# Altium schematic sheet PAGE113.SchDoc
size 386 x 284 mm
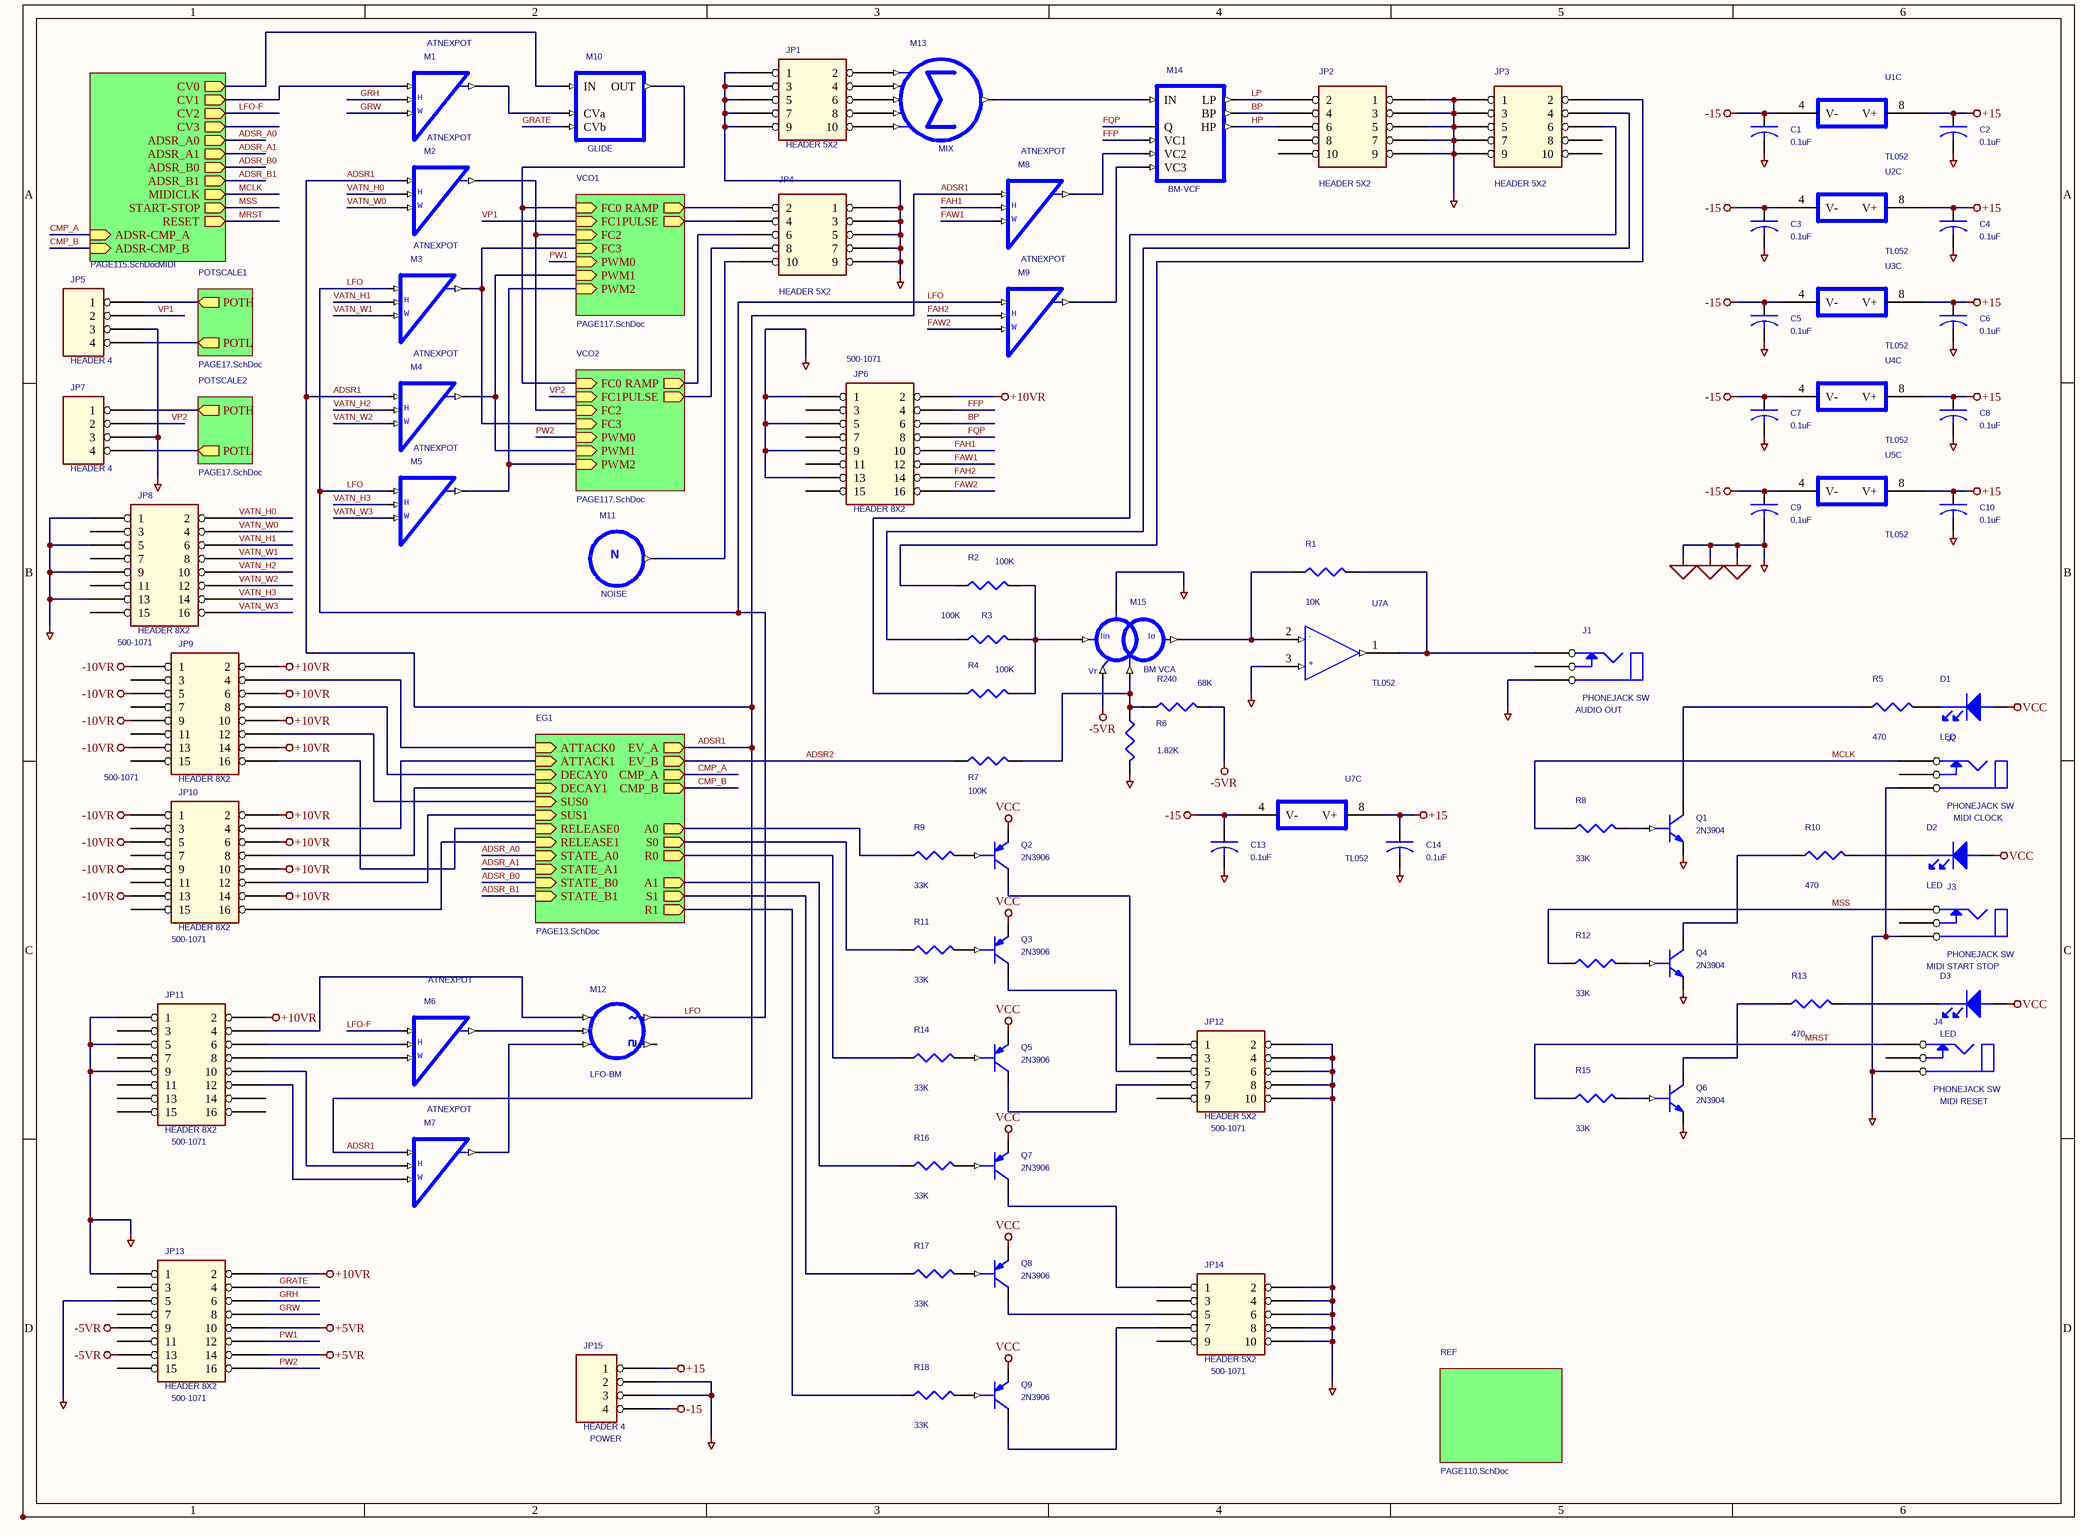
[diagram p0: PAGE113.SchDoc]

## Parts
C1  0.1uF  [AXIALCAP0.3]
C2  0.1uF  [AXIALCAP0.3]
C3  0.1uF  [AXIALCAP0.3]
C4  0.1uF  [AXIALCAP0.3]
C5  0.1uF  [AXIALCAP0.3]
C6  0.1uF  [AXIALCAP0.3]
C7  0.1uF  [AXIALCAP0.3]
C8  0.1uF  [AXIALCAP0.3]
C9  0.1uF  [AXIALCAP0.3]
C10  0.1uF  [AXIALCAP0.3]
C13  0.1uF  [AXIALCAP0.3]
C14  0.1uF  [AXIALCAP0.3]
D1  LED
D2  LED
D3  LED
J1  PHONEJACK SW  [PHONE-N114A]
J2  PHONEJACK SW  [PHONE-N114A]
J3  PHONEJACK SW  [PHONE-N114A]
J4  PHONEJACK SW  [PHONE-N114A]
JP1  HEADER 5X2  [IDC10-AMP]
JP2  HEADER 5X2  [IDC10-AMP]
JP3  HEADER 5X2  [IDC10-AMP]
JP4  HEADER 5X2  [IDC10-AMP]
JP5  HEADER 4  [MODU-4S-RA]
JP6  HEADER 8X2  [IDC16-AMP]
JP7  HEADER 4  [MODU-4S-RA]
JP8  HEADER 8X2  [IDC16-AMP]
JP9  HEADER 8X2  [IDC16-AMP]
JP10  HEADER 8X2  [IDC16-AMP]
JP11  HEADER 8X2  [IDC16-AMP]
JP12  HEADER 5X2  [IDC10-AMP]
JP13  HEADER 8X2  [IDC16-AMP]
JP14  HEADER 5X2  [IDC10-AMP]
JP15  HEADER 4  [MTA-4X156-RA]
M1  ATNEXPOT
M2  ATNEXPOT
M3  ATNEXPOT
M4  ATNEXPOT
M5  ATNEXPOT
M6  ATNEXPOT
M7  ATNEXPOT
M8  ATNEXPOT
M9  ATNEXPOT
M10  GLIDE
M11  NOISE
M12  LFO-BM
M13  MIX
M14  BM-VCF
M15  BM VCA
Q1  2N3904  [TO92]
Q2  2N3906  [TO92]
Q3  2N3906  [TO92]
Q4  2N3904  [TO92]
Q5  2N3906  [TO92]
Q6  2N3904  [TO92]
Q7  2N3906  [TO92]
Q8  2N3906  [TO92]
Q9  2N3906  [TO92]
R1  10K  [AXIAL0.4]
R2  100K  [AXIAL0.4]
R3  100K  [AXIAL0.4]
R4  100K  [AXIAL0.4]
R5  470  [AXIAL0.4]
R6  1.82K  [AXIAL0.4]
R7  100K  [AXIAL0.4]
R8  33K  [AXIAL0.4]
R9  33K  [AXIAL0.4]
R10  470  [AXIAL0.4]
R11  33K  [AXIAL0.4]
R12  33K  [AXIAL0.4]
R13  470  [AXIAL0.4]
R14  33K  [AXIAL0.4]
R15  33K  [AXIAL0.4]
R16  33K  [AXIAL0.4]
R17  33K  [AXIAL0.4]
R18  33K  [AXIAL0.4]
R240  68K  [AXIAL0.4]
U1  TL052  [DIP8]  (part C of 3)
U2  TL052  [DIP8]  (part C of 3)
U3  TL052  [DIP8]  (part C of 3)
U4  TL052  [DIP8]  (part C of 3)
U5  TL052  [DIP8]  (part C of 3)
U7  TL052  [DIP8]  (parts A,C of 3)

## Sub-sheets
EG1 = PAGE13.SchDoc: ATTACK0 (in), ATTACK1 (in), DECAY0 (in), DECAY1 (in), SUS0 (in), SUS1 (in), RELEASE0 (in), RELEASE1 (in), STATE_A0 (in), STATE_A1 (in), STATE_B0 (in), STATE_B1 (in), EV_A (out), EV_B (out), CMP_A (out), CMP_B (out), A0 (out), A1 (out), S0 (out), S1 (out), R0 (out), R1 (out)  | M26_PartReference: M26; M26_Q__11_PartReference: Q13; M26_Q__8_PartReference: Q10; M26_C__17_PartReference: C116; M26_U__17_PartReference: U11; M26_U__17_PACKAGE: ADSR_1; M26_Q__9_PartReference: Q11; M26_C__18_PartReference: C117; M26_R__43_PartReference: R28; M26_C__19_PartReference: C118; M26_U__12_PartReference: U12; M26_U__12_PACKAGE: ADSR_2; M26_R__44_PartReference: R31; M26_C__20_PartReference: C119; M26_R__45_PartReference: R33; M26_Q__10_PartReference: Q12; M26_C__15_PartReference: C20; M26_U__13_PartReference: U12; M26_U__13_PACKAGE: ADSR_2; M26_R__39_PartReference: R30; M26_U__14_PartReference: U11; M26_U__14_PACKAGE: ADSR_1; M26_C__16_PartReference: C21; M26_U__15_PartReference: U12; M26_U__15_PACKAGE: ADSR_2; M26_R__40_PartReference: R34; M26_U__16_PartReference: U11; M26_U__16_PACKAGE: ADSR_1; M26_R__41_PartReference: R32; M26_R__46_PartReference: R29; M26_R__42_PartReference: R37; M26_TitleBlock_7_Page_Number: 3; M26_TitleBlock_7_Title: SIMPLE EV GENERATOR M26; M27_PartReference: M27; M27_Q__11_PartReference: Q17; M27_Q__8_PartReference: Q14; M27_C__17_PartReference: C120; M27_U__17_PartReference: U13; M27_U__17_PACKAGE: ADSR_1_1; M27_Q__9_PartReference: Q15; M27_C__18_PartReference: C121; M27_R__43_PartReference: R38; M27_C__19_PartReference: C122; M27_U__12_PartReference: U14; M27_U__12_PACKAGE: ADSR_2_1; M27_R__44_PartReference: R41; M27_C__20_PartReference: C123; M27_R__45_PartReference: R43; M27_Q__10_PartReference: Q16; M27_C__15_PartReference: C22; M27_U__13_PartReference: U14; M27_U__13_PACKAGE: ADSR_2_1; M27_R__39_PartReference: R40; M27_U__14_PartReference: U13; M27_U__14_PACKAGE: ADSR_1_1; M27_C__16_PartReference: C23; M27_U__15_PartReference: U14; M27_U__15_PACKAGE: ADSR_2_1; M27_R__40_PartReference: R44; M27_U__16_PartReference: U13; M27_U__16_PACKAGE: ADSR_1_1; M27_R__41_PartReference: R42; M27_R__46_PartReference: R39; M27_R__42_PartReference: R47; M27_TitleBlock_7_Page_Number: 4; M27_TitleBlock_7_Title: SIMPLE EV GENERATOR M27; TitleBlock_Page_Number: 20; TitleBlock_Title: NOOTA-DUAL ENVELOPE GENERATOR
MIDI = PAGE115.SchDoc: CV0 (out), CV1 (out), CV2 (out), CV3 (out), ADSR_A0 (out), ADSR_A1 (out), ADSR_B0 (out), ADSR_B1 (out), MIDICLK (out), START-STOP (out), RESET (out), ADSR-CMP_A (in), ADSR-CMP_B (in)  | M26_PartReference: M26; M26_TitleBlock_1_Page_Number: 10; M26_TitleBlock_1_Title: MIDI CONNECTORS; U__4_PartReference: U9; M27_PartReference: M27; M27_C__21_PartReference: C41; M27_TitleBlock_1_Page_Number: 12; M27_TitleBlock_1_Title: MIDI CONNECTORS; U__5_PartReference: U9; U__6_PartReference: U9; M28_TitleBlock_1_Page_Number: 14; M28_TitleBlock_1_Title: MIDI CONNECTORS; M29_TitleBlock_4_Page_Number: 11; M31_C__13_PartReference: C48; M31_M34_C__21_PartReference: C66; M31_M34_TitleBlock_1_Page_Number: 28; M31_M34_TitleBlock_1_Title: MIDI CONNECTORS; M31_C__14_PartReference: U25; TitleBlock_Page_Number: 2; TitleBlock_Title: NOOTA-DUAL ENVELOPE GENERATOR
POTSCALE1 = PAGE17.SchDoc: POTH (out), POTL (out)  | R__16_PartReference: R133; M26_PartReference: U34; M26_PACKAGE: POTSCALE2; R__2_PartReference: R129; M27_PartReference: U34; M27_PACKAGE: POTSCALE2; R__3_PartReference: R128; U__PartReference: U34; U__PACKAGE: POTSCALE2; R__5_PartReference: R130; R__17_PartReference: R131; R__19_PartReference: R132; R__12_PartReference: R134; C__2_PartReference: C62; C__3_PartReference: C63; TitleBlock_Page_Number: 22; TitleBlock_Title: NOOTA-POT SCALE VCO 1
POTSCALE2 = PAGE17.SchDoc: POTH (out), POTL (out)  | R__16_PartReference: R141; M26_PartReference: U35; M26_PACKAGE: POTSCALE1; R__2_PartReference: R137; M27_PartReference: U35; M27_PACKAGE: POTSCALE1; R__3_PartReference: R136; U__PartReference: U35; U__PACKAGE: POTSCALE1; R__5_PartReference: R138; R__17_PartReference: R139; R__19_PartReference: R140; R__12_PartReference: R142; C__2_PartReference: C64; C__3_PartReference: C65; TitleBlock_Page_Number: 23; TitleBlock_Title: NOOTA-POT SCALE VCO 2
REF = PAGE110.SchDoc: no entries  | M26_PartReference: U50; U__4_PartReference: U50; M27_PartReference: U51; U__5_PartReference: U51; U__PartReference: Q57; U__PACKAGE: POTSCALE; C__8_PartReference: C113; U__6_PartReference: U50; Q__PartReference: Q58; R__PartReference: R225; TitleBlock_Page_Number: 40; TitleBlock_Title: NOOTA-DUAL ENVELOPE GENERATOR
VCO1 = PAGE117.SchDoc: FC0 (in), FC1 (in), FC2 (in), FC3 (in), PWM0 (in), PWM1 (in), PWM2 (in), RAMP (out), PULSE (out)  | R__34_PartReference: R102; R__1_PartReference: R100; R__35_PartReference: R98; R__23_PartReference: R92; M__1_PartReference: M22; M__1_M26_PartReference: U40; M__1_D__PartReference: D9; M__1_D__1_PartReference: D10; M__1_M27_PartReference: U40; M__1_C__PartReference: C78; M__1_U__PartReference: U40; M__1_U__PACKAGE: POTSCALE; M__1_C__1_PartReference: C79; M__1_R__7_PartReference: R160; M__1_R__10_PartReference: R161; M__1_R__11_PartReference: R159; M__1_R__13_PartReference: R158; M__1_R__20_PartReference: R162; M__1_R__21_PartReference: R164; M__1_R__22_PartReference: R163; M__1_TitleBlock_Page_Number: 31; M__1_TitleBlock_Title: NOOTA-DUAL ENVELOPE GENERATOR; M__PartReference: M21; M__U__18_PartReference: U39; M__C__23_PartReference: C74; M__Q__12_PartReference: Q40; M__U__19_PartReference: U38; M__C__22_PartReference: C71; M__C__24_PartReference: C73; M__C__25_PartReference: C72; M__C__26_PartReference: C75; M__R__49_PartReference: R154; M__C__27_PartReference: C76; M__R__50_PartReference: R157; M__R__47_PartReference: R155; M__R__48_PartReference: R156; M__TitleBlock_6_Page_Number: 30; R__4_PartReference: R99; R__28_PartReference: R89; R__24_PartReference: R94; R__37_PartReference: R87; U__8_PartReference: U28; U__8_PACKAGE: VCO1_1; C__9_PartReference: R105; C__9_PCB_Footprint: AXIAL0.4; C__11_PartReference: C52; R__25_PartReference: R95; R__18_PartReference: R88; R__38_PartReference: R91; R__29_PartReference: R106; R__9_PartReference: R90; R__PartReference: M20; R__M26_PartReference: Q38; R__U__7_PartReference: U37; R__U__7_PACKAGE: BMEXPO; R__M27_PartReference: Q39; R__U__2_PartReference: U37; R__U__2_PACKAGE: BMEXPO; R__U__PartReference: Q34; R__U__PACKAGE: POTSCALE; R__C__4_PartReference: C67; R__U__3_PartReference: U37; R__U__3_PACKAGE: BMEXPO; R__Q__PartReference: Q33; R__C__6_PartReference: C69; R__C__7_PartReference: C70; R__Q__1_PartReference: Q35; R__C__5_PartReference: C68; R__Q__2_PartReference: Q36; R__Q__3_PartReference: Q37; R__R__14_PartReference: R153; R__R__15_PartReference: R152; R__TitleBlock_Page_Number: 29; R__TitleBlock_Title: NOOTA-DUAL ENVELOPE GENERATOR; R__26_PartReference: R97; C__12_PartReference: C53; R__30_PartReference: R107; R__27_PartReference: R103; R__31_PartReference: R104; U__10_PartReference: U28; U__10_PACKAGE: VCO1_1; R__36_PartReference: R101; U__11_PartReference: U28; U__11_PACKAGE: VCO1_1; JP__PartReference: JP18; TitleBlock_Page_Number: 15; TitleBlock_Title: NOOTA-DUAL ENVELOPE GENERATOR
VCO2 = PAGE117.SchDoc: FC0 (in), FC1 (in), FC2 (in), FC3 (in), PWM0 (in), PWM1 (in), PWM2 (in), RAMP (out), PULSE (out)  | R__34_PartReference: R180; R__1_PartReference: R178; R__35_PartReference: R176; R__23_PartReference: R170; M__1_PartReference: M25; M__1_M26_PartReference: U45; M__1_M26_PACKAGE: RAMP_PWM1; M__1_D__PartReference: D11; M__1_D__1_PartReference: D12; M__1_M27_PartReference: U45; M__1_M27_PACKAGE: RAMP_PWM1; M__1_C__PartReference: C93; M__1_U__PartReference: U45; M__1_U__PACKAGE: RAMP_PWM1; M__1_C__1_PartReference: C94; M__1_R__7_PartReference: R194; M__1_R__10_PartReference: R195; M__1_R__11_PartReference: R193; M__1_R__13_PartReference: R192; M__1_R__20_PartReference: R196; M__1_R__21_PartReference: R198; M__1_R__22_PartReference: R197; M__1_TitleBlock_Page_Number: 35; M__1_TitleBlock_Title: NOOTA-DUAL ENVELOPE GENERATOR; M__PartReference: M24; M__U__18_PartReference: U44; M__C__23_PartReference: C89; M__Q__12_PartReference: Q48; M__U__19_PartReference: U43; M__C__22_PartReference: C86; M__C__24_PartReference: C88; M__C__25_PartReference: C87; M__C__26_PartReference: C90; M__R__49_PartReference: R188; M__C__27_PartReference: C91; M__R__50_PartReference: R191; M__R__47_PartReference: R189; M__R__48_PartReference: R190; M__TitleBlock_6_Page_Number: 34; R__4_PartReference: R177; R__28_PartReference: R167; R__24_PartReference: R172; R__37_PartReference: R165; U__8_PartReference: U41; U__8_PACKAGE: VCO1_2; C__9_PartReference: R183; C__9_PCB_Footprint: AXIAL0.4; C__11_PartReference: C80; R__25_PartReference: R173; R__18_PartReference: R166; R__38_PartReference: R169; R__29_PartReference: R184; R__9_PartReference: R168; R__PartReference: M23; R__M26_PartReference: Q46; R__U__7_PartReference: U42; R__U__7_PACKAGE: BMEXPO1; R__M27_PartReference: Q47; R__U__2_PartReference: U42; R__U__2_PACKAGE: BMEXPO1; R__U__PartReference: Q42; R__U__PACKAGE: POTSCALE; R__C__4_PartReference: C82; R__U__3_PartReference: U42; R__U__3_PACKAGE: BMEXPO1; R__Q__PartReference: Q41; R__C__6_PartReference: C84; R__C__7_PartReference: C85; R__Q__1_PartReference: Q43; R__C__5_PartReference: C83; R__Q__2_PartReference: Q44; R__Q__3_PartReference: Q45; R__R__14_PartReference: R187; R__R__15_PartReference: R186; R__TitleBlock_Page_Number: 33; R__TitleBlock_Title: NOOTA-DUAL ENVELOPE GENERATOR; R__26_PartReference: R175; C__12_PartReference: C81; R__30_PartReference: R185; R__27_PartReference: R181; R__31_PartReference: R182; U__10_PartReference: U41; U__10_PACKAGE: VCO1_2; R__36_PartReference: R179; U__11_PartReference: U41; U__11_PACKAGE: VCO1_2; JP__PartReference: JP19; TitleBlock_Page_Number: 32; TitleBlock_Title: NOOTA-DUAL ENVELOPE GENERATOR

## Nets
+5VR: JP13.10 JP13.14
+10VR: JP6.2 JP9.2 JP9.6 JP9.10 JP9.14 JP10.2 JP10.6 JP10.10 JP10.14 JP11.2 JP13.2
+15: C2.1 C4.1 C6.1 C8.1 C10.1 C14.1 JP15.1 U1.8(V+) U2.8(V+) U3.8(V+) U4.8(V+) U5.8(V+) U7.8(V+)
-5VR: JP13.9 JP13.13 M15.-VR R240.2
-10VR: JP9.1 JP9.5 JP9.9 JP9.13 JP10.1 JP10.5 JP10.9 JP10.13
-15: C1.1 C3.1 C5.1 C7.1 C9.1 C13.1 JP15.4 U1.4(V-) U2.4(V-) U3.4(V-) U4.4(V-) U5.4(V-) U7.4(V-)
AGND: C1.2 C2.2 C3.2 C4.2 C5.2 C6.2 C7.2 C8.2 C9.2 C10.2 C13.2 C14.2 J1.3 J2.3 J3.3 J4.3 JP1.1 JP1.3 JP1.5 JP1.7 JP1.9 JP2.1 JP2.3 JP2.5 JP2.7 JP2.9 JP3.1 JP3.3 JP3.5 JP3.7 JP3.9 JP4.1 JP4.3 JP4.5 JP4.7 JP4.9 JP5.3 JP6.1 JP6.5 JP6.9 JP6.13 JP7.3 JP8.1 JP8.5 JP8.9 JP8.13 JP11.1 JP11.5 JP11.9 JP12.2 JP12.4 JP12.6 JP12.8 JP12.10 JP13.1 JP13.5 JP14.2 JP14.4 JP14.6 JP14.8 JP14.10 JP15.2 JP15.3 M15.CVN Q1.EMITTER Q4.EMITTER Q6.EMITTER R6.2 U7.3(+)  [also labelled GND, VEE, VSS]
VCC: D1.ANODE D2.ANODE D3.ANODE Q2.EMITTER Q3.EMITTER Q5.EMITTER Q7.EMITTER Q8.EMITTER Q9.EMITTER
ADSR1: M2.IN M4.IN M7.IN M8.IN ; sheet EG1/EV_A
ADSR2: R7.1 ; sheet EG1/EV_B
ADSR_A0: sheet EG1/STATE_A0, sheet MIDI/ADSR_A0
ADSR_A1: sheet EG1/STATE_A1, sheet MIDI/ADSR_A1
ADSR_B0: sheet EG1/STATE_B0, sheet MIDI/ADSR_B0
ADSR_B1: sheet EG1/STATE_B1, sheet MIDI/ADSR_B1
BP: JP2.4 JP6.6 M14.BP
CMP_A: sheet EG1/CMP_A, sheet MIDI/ADSR-CMP_A
CMP_B: sheet EG1/CMP_B, sheet MIDI/ADSR-CMP_B
FAH1: JP6.10 M8.POT_H
FAH2: JP6.14 M9.POT_H
FAW1: JP6.12 M8.POT_W
FAW2: JP6.16 M9.POT_W
FFP: JP6.4 M14.VC1
FQP: JP6.8 M14.Q
GRATE: JP13.4 M10.CVb
GRH: JP13.6 M1.POT_H
GRW: JP13.8 M1.POT_W
HP: JP2.6 M14.HP
LFO: M3.IN M5.IN M9.IN M12.TRI
LFO-F: M6.IN ; sheet MIDI/CV2
LP: JP2.2 M14.LP
MCLK: J2.1 R8.1 ; sheet MIDI/MIDICLK
MRST: J4.1 R15.1 ; sheet MIDI/RESET
MSS: J3.1 R12.1 ; sheet MIDI/START-STOP
PW1: JP13.12 ; sheet VCO1/PWM0
PW2: JP13.16 ; sheet VCO2/PWM0
VATN_H0: JP8.2 M2.POT_H
VATN_H1: JP8.6 M3.POT_H
VATN_H2: JP8.10 M4.POT_H
VATN_H3: JP8.14 M5.POT_H
VATN_W0: JP8.4 M2.POT_W
VATN_W1: JP8.8 M3.POT_W
VATN_W2: JP8.12 M4.POT_W
VATN_W3: JP8.16 M5.POT_W
VP1: JP5.2 ; sheet VCO1/FC1
VP2: JP7.2 ; sheet VCO2/FC1
NetD1_CATHODE: D1.CATHODE R5.2
NetD2_CATHODE: D2.CATHODE R10.2
NetD3_CATHODE: D3.CATHODE R13.2
NetJ1_1: J1.1 R1.2 U7.1(OUT)
NetJP1_2: JP1.2 M13.I1
NetJP1_4: JP1.4 M13.I2
NetJP1_6: JP1.6 M13.I3
NetJP1_8: JP1.8 M13.I4
NetJP1_10: JP1.10 M13.I5
NetJP3_2: JP3.2 R2.1
NetJP3_4: JP3.4 R3.1
NetJP3_6: JP3.6 R4.1
NetJP4_2: JP4.2 ; sheet VCO1/RAMP
NetJP4_4: JP4.4 ; sheet VCO1/PULSE
NetJP4_6: JP4.6 ; sheet VCO2/RAMP
NetJP4_8: JP4.8 ; sheet VCO2/PULSE
NetJP4_10: JP4.10 M11.NOISE
NetJP5_1: JP5.1 ; sheet POTSCALE1/POTH
NetJP5_4: JP5.4 ; sheet POTSCALE1/POTL
NetJP7_1: JP7.1 ; sheet POTSCALE2/POTH
NetJP7_4: JP7.4 ; sheet POTSCALE2/POTL
NetJP9_4: JP9.4 ; sheet EG1/ATTACK0
NetJP9_8: JP9.8 ; sheet EG1/DECAY0
NetJP9_12: JP9.12 ; sheet EG1/SUS0
NetJP9_16: JP9.16 ; sheet EG1/RELEASE0
NetJP10_4: JP10.4 ; sheet EG1/ATTACK1
NetJP10_8: JP10.8 ; sheet EG1/DECAY1
NetJP10_12: JP10.12 ; sheet EG1/SUS1
NetJP10_16: JP10.16 ; sheet EG1/RELEASE1
NetJP11_4: JP11.4 M12.FC3
NetJP11_6: JP11.6 M6.POT_H
NetJP11_8: JP11.8 M6.POT_W
NetJP11_10: JP11.10 M7.POT_H
NetJP11_12: JP11.12 M7.POT_W
NetJP12_1: JP12.1 Q2.COLLECTOR
NetJP12_5: JP12.5 Q3.COLLECTOR
NetJP12_7: JP12.7 Q5.COLLECTOR
NetJP14_1: JP14.1 Q7.COLLECTOR
NetJP14_5: JP14.5 Q8.COLLECTOR
NetJP14_7: JP14.7 Q9.COLLECTOR
NetM1_IN: M1.IN ; sheet MIDI/CV1
NetM1_OUT: M1.OUT M10.CVa
NetM2_OUT: M2.OUT ; sheet VCO1/FC2, sheet VCO2/FC2
NetM3_OUT: M3.OUT ; sheet VCO1/FC3, sheet VCO2/FC3
NetM4_OUT: M4.OUT ; sheet VCO1/PWM1, sheet VCO2/PWM1
NetM5_OUT: M5.OUT ; sheet VCO1/PWM2, sheet VCO2/PWM2
NetM6_OUT: M6.OUT M12.FC2
NetM7_OUT: M7.OUT M12.FC1
NetM8_OUT: M8.OUT M14.VC2
NetM9_OUT: M9.OUT M14.VC3
NetM10_IN: M10.IN ; sheet MIDI/CV0
NetM10_OUT: M10.OUT ; sheet VCO1/FC0, sheet VCO2/FC0
NetM13_OUT: M13.OUT M14.IN
NetM15_CVP: M15.CVP R6.1 R7.2 R240.1
NetM15_Iin: M15.Iin R2.2 R3.2 R4.2
NetM15_Io: M15.Io R1.1 U7.2(-)
NetQ1_BASE: Q1.BASE R8.2
NetQ1_COLLECTOR: Q1.COLLECTOR R5.1
NetQ2_BASE: Q2.BASE R9.2
NetQ3_BASE: Q3.BASE R11.2
NetQ4_BASE: Q4.BASE R12.2
NetQ4_COLLECTOR: Q4.COLLECTOR R10.1
NetQ5_BASE: Q5.BASE R14.2
NetQ6_BASE: Q6.BASE R15.2
NetQ6_COLLECTOR: Q6.COLLECTOR R13.1
NetQ7_BASE: Q7.BASE R16.2
NetQ8_BASE: Q8.BASE R17.2
NetQ9_BASE: Q9.BASE R18.2
NetR9_1: R9.1 ; sheet EG1/A0
NetR11_1: R11.1 ; sheet EG1/S0
NetR14_1: R14.1 ; sheet EG1/R0
NetR16_1: R16.1 ; sheet EG1/A1
NetR17_1: R17.1 ; sheet EG1/S1
NetR18_1: R18.1 ; sheet EG1/R1

Not connected (* = marked no-connect by the designer): J1 2; J2 2; J3 2; J4 2; JP2 8 10; JP3 8 10; JP6 3 7 11 15; JP8 3 7 11 15; JP9 3 7 11 15; JP10 3 7 11 15; JP11 3 7 11 13 14 15 16; JP12 3 9; JP13 3 7 11 15; JP14 3 9; M12 SQR

## Notes on the sheet
- (near JP6) 500-1071
- 500-1071
- (near J1) AUDIO OUT
- MIDI CLOCK
- (near JP10) 500-1071
- MIDI START STOP
- (near JP12) 500-1071
- (near J4) MIDI RESET
- (near JP11) 500-1071
- (near JP13) 500-1071
- (near JP14) 500-1071
- (near JP15) POWER
- (in symbol ATNEXPOT) H; W
- (in symbol BM VCA) Vr
- (in symbol NOISE) N

## Library data of the parts
C1-C10 C13 C14 = CAP_Dup1
JP5 JP7 = HEADER 4_Dup1
M1 = ATNEXPOT: R__6_PartReference: R108; R__8_PartReference: R109; U__1_PartReference: U1; U__1_PACKAGE: ATNM1MIX; TitleBlock_1_Title: NOOTA - CV ATN -1; TitleBlock_1_Page_Number: 16
M2 = ATNEXPOT: R__6_PartReference: R114; R__8_PartReference: R115; U__1_PartReference: U5; U__1_PACKAGE: ATNM2M3; TitleBlock_1_Title: NOOTA - CV ATN-2; TitleBlock_1_Page_Number: 19
M3 = ATNEXPOT: R__6_PartReference: R110; R__8_PartReference: R111; U__1_PartReference: U5; U__1_PACKAGE: ATNM2M3; TitleBlock_1_Title: NOOTA - CV ATN -3; TitleBlock_1_Page_Number: 17
M4 = ATNEXPOT: R__6_PartReference: R112; R__8_PartReference: R113; U__1_PartReference: U3; U__1_PACKAGE: ATNM4M5; TitleBlock_1_Title: NOOTA - CV ATN-4; TitleBlock_1_Page_Number: 18
M5 = ATNEXPOT: R__6_PartReference: R126; R__8_PartReference: R127; U__1_PartReference: U3; U__1_PACKAGE: ATNM4M5; TitleBlock_1_Title: NOOTA - CV ATN-5; TitleBlock_1_Page_Number: 21
M6 = ATNEXPOT: R__6_PartReference: R148; R__8_PartReference: R149; U__1_PartReference: U4; U__1_PACKAGE: ATNM6M7; TitleBlock_1_Title: NOOTA - CV ATN-6; TitleBlock_1_Page_Number: 26
M7 = ATNEXPOT: R__6_PartReference: R150; R__8_PartReference: R151; U__1_PartReference: U4; U__1_PACKAGE: ATNM6M7; TitleBlock_1_Title: NOOTA - CV ATN-7; TitleBlock_1_Page_Number: 27
M8 = ATNEXPOT: R__6_PartReference: R146; R__8_PartReference: R147; U__1_PartReference: U2; U__1_PACKAGE: ATNM8M9; TitleBlock_1_Title: NOOTA - CV ATN-8; TitleBlock_1_Page_Number: 25
M9 = ATNEXPOT: R__6_PartReference: R144; R__8_PartReference: R145; U__1_PartReference: U2; U__1_PACKAGE: ATNM8M9; TitleBlock_1_Title: NOOTA - CV ATN-9; TitleBlock_1_Page_Number: 24
M10 = GLIDE: TitleBlock_4_Page_Number: 7
M11 = NOISE: C__8_PartReference: R58; C__9_PartReference: C29; C__9_PCB_Footprint: RB5/2; TitleBlock_2_Page_Number: 6; TitleBlock_2_Title: NOOTA- CHEEZY MIXER
M12 = LFO-BM: M1_1_TitleBlock_2_Page_Number: 5; M1_1_TitleBlock_2_Title: NOOTA- CHEEZY MIXER
M13 = MIX: TitleBlock_2_Page_Number: 9; TitleBlock_2_Title: NOOTA- CHEEZY MIXER
M14 = BM-VCF: C__13_PartReference: C98; M16_U__9_PartReference: U47; M16_Q__7_PartReference: Q49; M16_Q__4_PartReference: Q51; M16_Q__5_PartReference: Q50; M16_Q__6_PartReference: Q52; M16_R__32_PartReference: R211; M16_R__33_PartReference: R212; M16_C__10_PartReference: C103; C__14_PartReference: C100; M17_U__9_PartReference: U48; M17_Q__7_PartReference: Q53; M17_Q__4_PartReference: Q55; M17_Q__5_PartReference: Q54; M17_Q__6_PartReference: Q56; M17_R__32_PartReference: R213; M17_R__33_PartReference: R214; M17_C__10_PartReference: C104; M16_U__9_PACKAGE: VCF1; M16_TitleBlock_2_Page_Number: 37; M16_TitleBlock_2_Title: NOOTA-BLACKMER VCA-VCF M16; M17_U__9_PACKAGE: VCF2; M17_TitleBlock_2_Page_Number: 38; M17_TitleBlock_2_Title: NOOTA-BLACKMER VCA-VCF M17; TitleBlock_1_Page_Number: 36; TitleBlock_1_Title: MIDI CONNECTORS
M15 = BM VCA: U__9_PartReference: U7; Q__7_PartReference: Q29; Q__4_PartReference: Q31; Q__5_PartReference: Q30; Q__6_PartReference: Q32; R__32_PartReference: R71; R__33_PartReference: R72; C__10_PartReference: C37; TitleBlock_2_Page_Number: 8; TitleBlock_2_Title: NOOTA-BLACKMER VCA M15; U__9_PACKAGE: VCA
Q1 Q4 Q6 = NPN
Q2 Q3 Q5 Q7-Q9 = PNP
R1-R18 R240 = R_Dup1
U1-U5 U7 = GEN DUAL OPAMP-H
  U1: PACKAGE: ATNM1MIX
  U2: PACKAGE: ATNM8M9
  U3: PACKAGE: ATNM4M5
  U4: PACKAGE: ATNM6M7
  U5: PACKAGE: ATNM2M3
  U7: PACKAGE: VCA